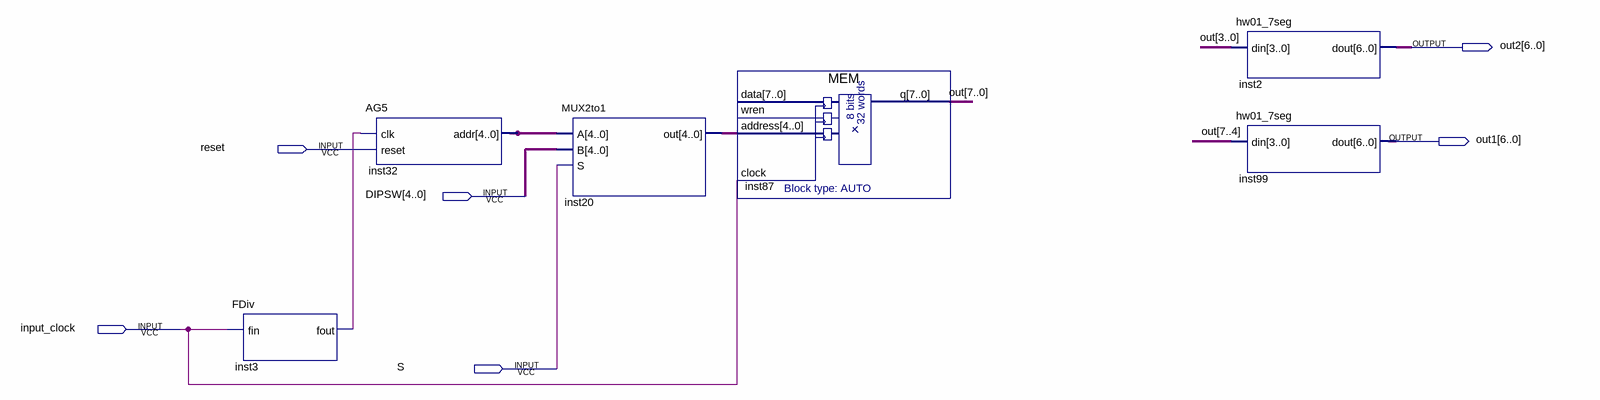
[diagram p0: schematic sheet]
// Quartus schematic test.bdf as structural Verilog: 6 symbols, 6 pins
module test (
  input  reset,
  input  [4:0] DIPSW,
  input  input_clock,
  input  S,
  output [6:0] out2,
  output [6:0] out1
);

  wire inst3_fout;
  wire [4:0] inst20_out, inst32_addr;
  wire [7:0] out;

  FDiv inst3 (.fin(input_clock), .fout(inst3_fout));
  AG5 inst32 (.clk(inst3_fout), .reset(reset), .addr(inst32_addr));
  MUX2to1 inst20 (.A(inst32_addr), .B(DIPSW), .S(S), .out(inst20_out));
  MEM inst87 (.address(inst20_out), .clock(input_clock), .q(out));  // open: data, wren
  hw01_7seg inst2 (.din(out[3:0]), .dout(out2));
  hw01_7seg inst99 (.din(out[7:4]), .dout(out1));
endmodule
